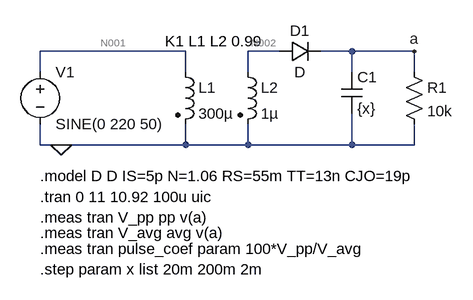
[diagram p0: schematic 1.4.asc]
1.4.asc, the LTspice schematic file:
Version 4
SHEET 1 880 680
WIRE 320 80 96 80
WIRE 464 80 416 80
WIRE 576 80 528 80
WIRE 672 80 576 80
WIRE 96 112 96 80
WIRE 320 112 320 80
WIRE 416 112 416 80
WIRE 576 112 576 80
WIRE 672 112 672 80
WIRE 96 224 96 192
WIRE 128 224 96 224
WIRE 320 224 320 192
WIRE 320 224 128 224
WIRE 416 224 416 192
WIRE 416 224 320 224
WIRE 576 224 576 176
WIRE 576 224 416 224
WIRE 672 224 672 192
WIRE 672 224 576 224
FLAG 128 224 0
FLAG 672 80 a
SYMBOL voltage 96 96 R0
WINDOW 123 0 0 Left 0
WINDOW 39 0 0 Left 0
SYMATTR InstName V1
SYMATTR Value SINE(0 220 50)
SYMBOL ind2 304 96 R0
SYMATTR InstName L1
SYMATTR Value 300µ
SYMATTR SpiceLine Rser=10m
SYMATTR Type ind
SYMBOL ind2 400 96 R0
SYMATTR InstName L2
SYMATTR Value 1µ
SYMATTR SpiceLine Rser=10m
SYMATTR Type ind
SYMBOL diode 464 96 R270
WINDOW 0 32 32 VTop 2
WINDOW 3 0 32 VBottom 2
SYMATTR InstName D1
SYMBOL cap 560 112 R0
SYMATTR InstName C1
SYMATTR Value {x}
SYMBOL res 656 96 R0
SYMATTR InstName R1
SYMATTR Value 10k
TEXT 96 272 Left 2 !.model D D IS=5p N=1.06 RS=55m TT=13n CJO=19p
TEXT 96 304 Left 2 !.tran 0 11 10.92 100u uic
TEXT 96 336 Left 2 !.meas tran V_pp pp v(a)
TEXT 96 360 Left 2 !.meas tran V_avg avg v(a)
TEXT 96 384 Left 2 !.meas tran pulse_coef param 100*V_pp/V_avg
TEXT 288 64 Left 2 !K1 L1 L2 0.99
TEXT 96 416 Left 2 !.step param x list 20m 200m 2m

The netlist it stands for:
* 1.4.asc
V1 N001 0 SINE(0 220 50)
L1 N001 0 300µ Rser=10m
L2 N002 0 1µ Rser=10m
D1 N002 a D
C1 a 0 {x}
R1 a 0 10k
.model D D
.lib standard.dio
.model D D IS=5p N=1.06 RS=55m TT=13n CJO=19p
.tran 0 11 10.92 100u uic
.meas tran V_pp pp v(a)
.meas tran V_avg avg v(a)
.meas tran pulse_coef param 100*V_pp/V_avg
K1 L1 L2 0.99
.step param x list 20m 200m 2m
.backanno
.end

* Results of the author's LTspice run, read from the files saved beside the schematic
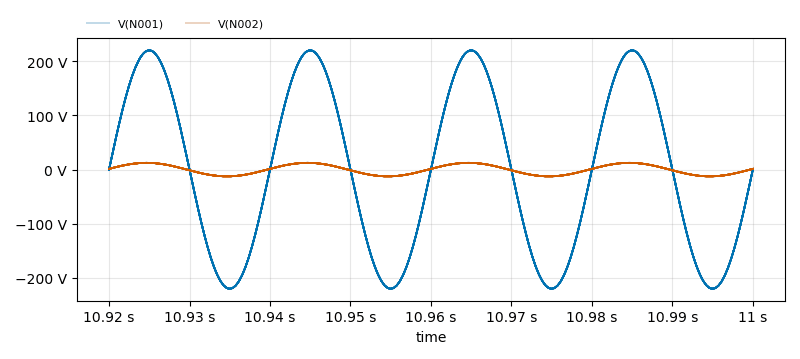
[diagram p1: Transient Analysis of 1.4.asc, plotted from the saved traces]
* Transient Analysis, 19 runs:
*   V(N001) [run 1]: min -220 V, max 220 V, average 27.5 mV, rms 155.6 V, last 0 V
*   V(N001) [run 2]: min -220 V, max 220 V, average 27 mV, rms 155.6 V, last 0 V
*   V(N001) [run 3]: min -220 V, max 220 V, average 27.33 mV, rms 155.6 V, last 0 V
*   V(N001) [run 4]: min -220 V, max 220 V, average 27.38 mV, rms 155.6 V, last 0 V
*   V(N001) [run 5]: min -220 V, max 220 V, average 26.31 mV, rms 155.6 V, last 0 V
*   V(N001) [run 6]: min -220 V, max 220 V, average 27.78 mV, rms 155.6 V, last 0 V
*   V(N001) [run 7]: min -220 V, max 220 V, average 26.88 mV, rms 155.6 V, last 0 V
*   V(N001) [run 8]: min -219.9 V, max 220 V, average 27.82 mV, rms 155.6 V, last 0 V
*   V(N002) [run 1]: min -12.5 V, max 12.5 V, average 1.68 mV, rms 8.842 V, last 1.319 V
*   V(N002) [run 2]: min -12.5 V, max 12.5 V, average 1.651 mV, rms 8.842 V, last 1.319 V
*   V(N002) [run 3]: min -12.5 V, max 12.5 V, average 1.664 mV, rms 8.842 V, last 1.319 V
*   V(N002) [run 4]: min -12.5 V, max 12.5 V, average 1.67 mV, rms 8.842 V, last 1.319 V
*   V(N002) [run 5]: min -12.5 V, max 12.5 V, average 1.617 mV, rms 8.842 V, last 1.319 V
*   V(N002) [run 6]: min -12.5 V, max 12.5 V, average 1.693 mV, rms 8.842 V, last 1.319 V
*   V(N002) [run 7]: min -12.5 V, max 12.5 V, average 1.637 mV, rms 8.842 V, last 1.319 V
*   V(N002) [run 8]: min -12.5 V, max 12.5 V, average 1.706 mV, rms 8.842 V, last 1.319 V
* From the log:
*   Measurement: v_pp
*     step  PP(v(a))  FROM  TO
*        1  0.00113392  0  0.08
*        2  0.000756264  0  0.08
*        3  0.000567436  0  0.08
*        4  0.000452995  0  0.08
*        5  0.000376701  0  0.08
*        6  0.000326157  0  0.08
*        7  0.000288963  0  0.08
*        8  0.000263214  0  0.08
*        9  0.000245094  0  0.08
*       10  0.000231743  0  0.08
*       11  0.00022316  0  0.08
*       12  0.000216484  0  0.08
*       13  0.000212669  0  0.08
*       14  0.000209808  0  0.08
*       15  0.000208855  0  0.08
*       16  0.000208855  0  0.08
*       17  0.000209808  0  0.08
*       18  0.000211716  0  0.08
*       19  0.000214577  0  0.08
*   Measurement: v_avg
*     step  AVG(v(a))  FROM  TO
*        1  11.8637  0  0.08
*        2  11.8637  0  0.08
*        3  11.8637  0  0.08
*        4  11.8637  0  0.08
*        5  11.8637  0  0.08
*        6  11.8636  0  0.08
*        7  11.8635  0  0.08
*        8  11.8633  0  0.08
*        9  11.8631  0  0.08
*       10  11.8628  0  0.08
*       11  11.8624  0  0.08
*       12  11.862  0  0.08
*       13  11.8615  0  0.08
*       14  11.861  0  0.08
*       15  11.8604  0  0.08
*       16  11.8598  0  0.08
*       17  11.8591  0  0.08
*       18  11.8585  0  0.08
*       19  11.8578  0  0.08
*   Measurement: pulse_coef
*     step  100*v_pp/v_avg
*        1  0.00955788
*        2  0.0063746
*        3  0.00478295
*        4  0.00381833
*        5  0.00317525
*        6  0.00274922
*        7  0.00243574
*        8  0.00221872
*        9  0.00206603
*       10  0.00195353
*       11  0.00188124
*       12  0.00182503
*       13  0.00179294
*       14  0.0017689
*       15  0.00176094
*       16  0.00176103
*       17  0.00176917
*       18  0.00178535
*       19  0.00180958